# EasyEDA Pro project Balloon_PCB_Ver1.0.1.epro

# Board PCB（四层板）
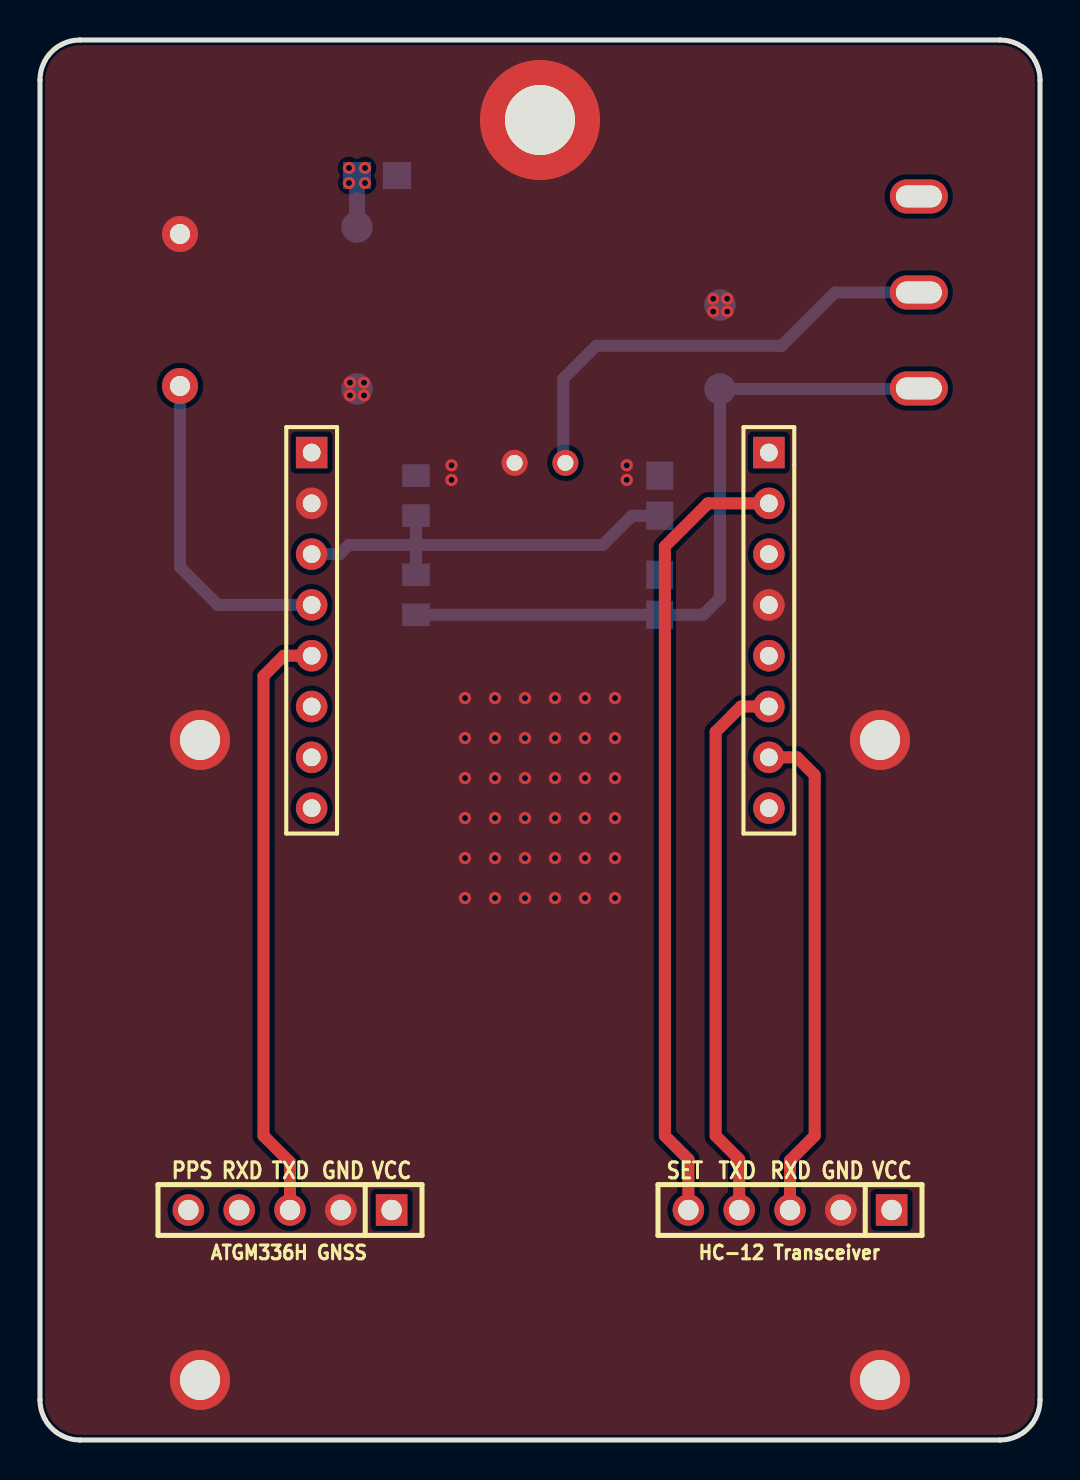
[diagram p0: board, top side]
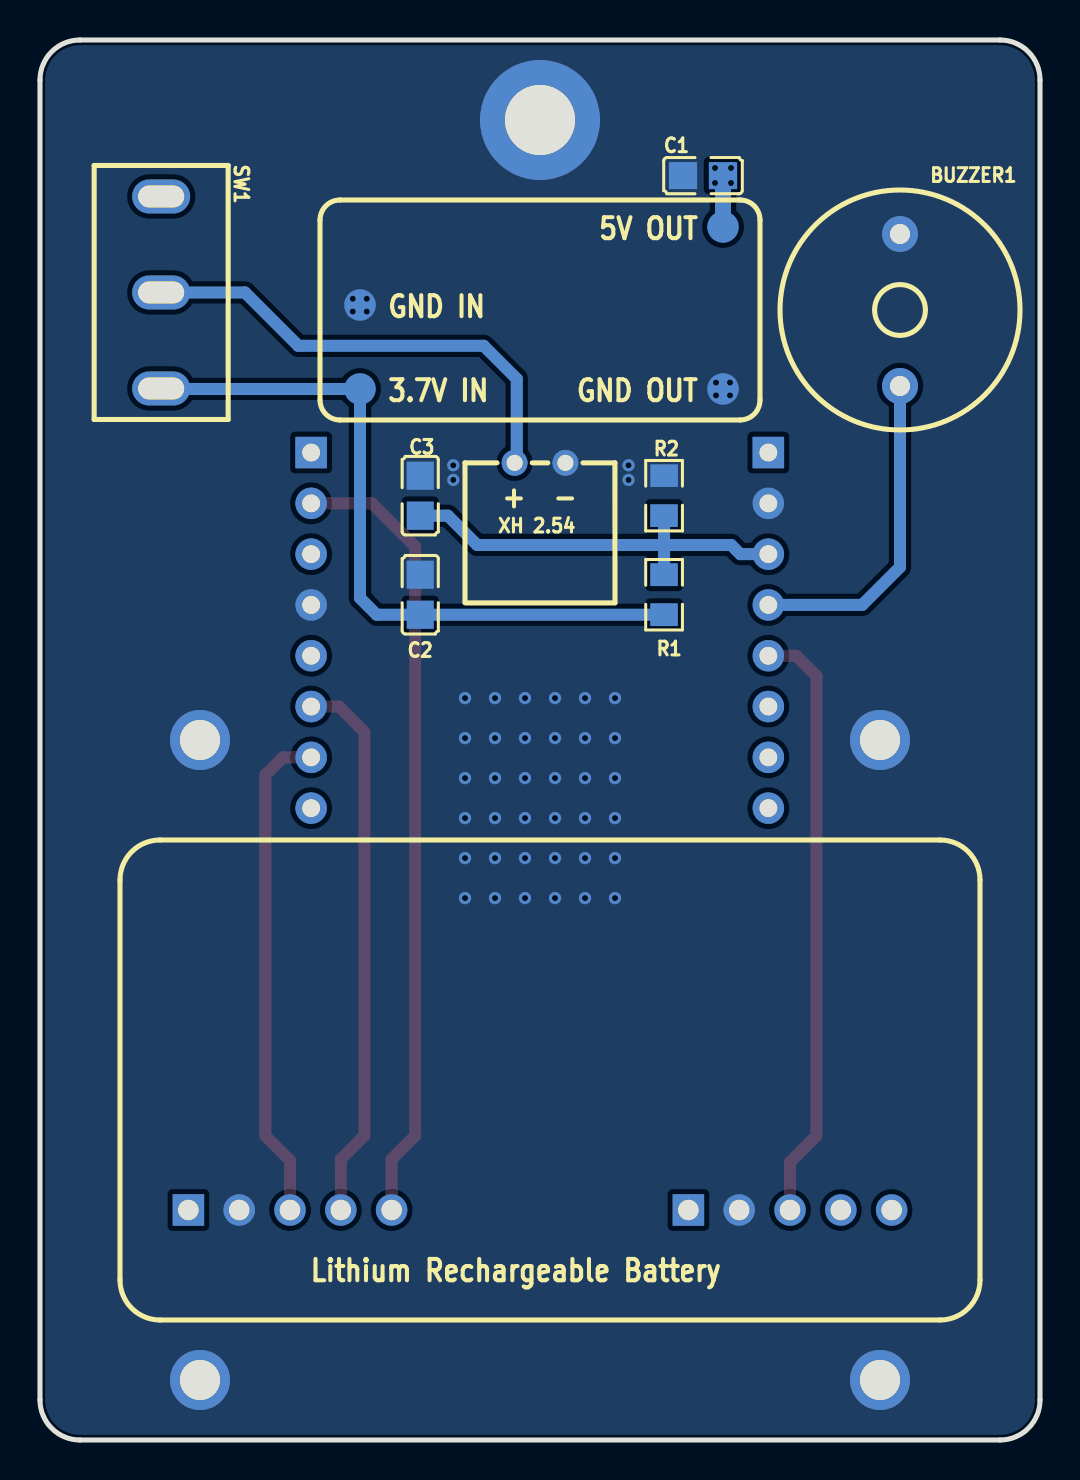
[diagram p1: board, bottom side, seen from below]

Outline 50 x 70 mm; copper layers: Top Layer, Inner1, Inner2, Bottom Layer. Coordinates in mm from the lower left corner of the outline.
Outline path: 0,68 0,2 arc(0.59,0.59) 2,0 48,0 arc(49.41,0.59) 50,2 50,68 arc(49.41,69.41) 48,70 2,70 arc(0.59,69.41) 0,68
Stack: Top Layer 0.035mm 外层铜厚1oz / Dielectric1 0.2104mm 7628 RC49% 8.6mil / Inner1 0.0152mm 内层铜厚 / Dielectric2 1.065mm 1.1mm H/HOZ Copper / Inner2 0.0152mm 内层铜厚 / Dielectric3 0.2104mm 7628 RC49% 8.6mil / Bottom Layer 0.035mm 外层铜厚1oz

## Design rules (mm)
template: 自定义配置
spacing copperThickness1oz (default): track to track 0.102, other pairs 0.152 to 0.3
spacing copperThickness2oz: track to track 0.203, other pairs 0.152 to 0.3
track width copperThickness1oz (default): min 0.127, default 0.254, max 2.54
track width copperThickness2oz: min 0.203, default 0.254, max 2.54
differential pair differentialPair (default): width min 0.127, default 0.254, max 2.54; gap min 0.152, default 0.152
via viaSize (default): diameter min 0.5, default 0.61, max 10; hole min 0.3, default 0.305, max 6.3
net GND uses copperThickness2oz
net 3.7V uses copperThickness2oz
net 5.0V uses copperThickness2oz
net GPSTX uses copperThickness2oz
net HCTX uses copperThickness2oz
net HTRX uses copperThickness2oz
net BUZZ+ uses copperThickness2oz

## Placement (name value [footprint] x y rotation side)
ATGM336H GNSS  B254YP-ZD05P  [HDR-TH_5P-P2.54-V-F]  12.5 11.5 180 top
BUZZER1  2.4kHz  [BUZ-TH_BD12.0-P7.60-D0.6-FD]  7 56.5 90 bottom
C1  22nF  [C0805]  16.85 63.22 180 bottom
C2  100nF  [C0805]  30.99 42.26 270 bottom
C3  100nF  [C0805]  30.99 47.22 270 bottom
ESP32 CAM  -  [ESP32-CAM]  11.5 67 0 top
HC-12 Transceiver  B254YP-ZD05P  [HDR-TH_5P-P2.54-V-F]  37.5 11.5 180 top
NOREF  -  [Pad_e14]  25 66 0 top
NOREF#2  -  [Pad_e609]  42 35 0 top
NOREF#3  -  [Pad_e611]  8 3 0 top
NOREF#4  -  [Pad_e295]  34 52.55 90 top
NOREF#5  -  [Pad_e296]  15.85 52.55 90 top
NOREF#6  -  [Pad_e610]  42 3 0 top
NOREF#7  -  [Pad_e607]  8 35 0 top
NOREF#8  -  [Pad_e294]  34 56.75 90 top
NOREF#9  -  [Pad_e297]  15.85 60.65 90 top
R1  10kΩ  [R0805]  18.8 42.26 90 bottom
R2  1kΩ  [R0805]  18.8 47.22 270 bottom
SW1  SS12D10G4 071  [SW-TH_SHOU-HAN_SS12D10G4]  43.94 57.38 270 bottom
XH 2.54  2.54-2P WZ-D  [CONN-TH_2P-P2.54_WZ-D]  25 48.86 180 bottom

## Footprints (pads in the part's own frame, mm; a bottom-side part is the same pattern mirrored in y, then rotated)
BUZ-TH_BD12.0-P7.60-D0.6-FD
  round 1.8 hole 1: 1(-3.8,0) 2(3.8,0)
C0805
  rect 1.41x1.35 smd: 1(-1,0) 2(1,0)
CONN-TH_2P-P2.54_WZ-D
  round 1.3 hole 0.8: 1(-1.27,0) 2(1.27,0)
ESP32-CAM
  rect 1.575x1.575 hole 0.889: 1(2.083,-17.628) 16(24.943,-17.628)
  round 1.575 hole 0.889: 2(2.083,-20.168) 3(2.083,-22.707) 4(2.083,-25.247) 5(2.083,-27.788) 6(2.083,-30.328) 7(2.083,-32.867) 8(2.083,-35.407) 9(24.943,-35.407) 10(24.943,-32.867) 11(24.943,-30.328) 12(24.943,-27.788) 13(24.943,-25.247) 14(24.943,-22.707) 15(24.943,-20.168)
HDR-TH_5P-P2.54-V-F
  rect 1.575x1.575 hole 1.02: 1(-5.08,0)
  round 1.575 hole 1.02: 2(-2.54,0) 3(0,0) 4(2.54,0) 5(5.08,0)
Pad_e14
  round 6 hole 3.5: 1(0,0)
Pad_e294
  round 1.575 smd far side: 1(0,0)
Pad_e295
  round 1.575 smd far side: 2(0,0)
Pad_e296
  round 1.575 smd far side: 3(0,0)
Pad_e297
  round 1.575 smd far side: 4(0,0)
Pad_e607
  round 3 hole 2: 1(0,0)
Pad_e609
  round 3 hole 2: 1(0,0)
Pad_e610
  round 3 hole 2: 1(0,0)
Pad_e611
  round 3 hole 2: 1(0,0)
R0805
  rect 1.133x1.377 smd: 1(-1,0) 2(1,0)
SW-TH_SHOU-HAN_SS12D10G4
  oval 1.7x2.9 hole 1.1x2.3: 1(-4.8,0) 2(0,0) 3(4.8,0)

## Nets
3.7V: C2.2 NOREF#4.2 R1.1 SW1.3
5.0V: ATGM336H GNSS.1 C1.2 ESP32 CAM.1 HC-12 Transceiver.1 NOREF#9.4
GND: ATGM336H GNSS.2 BUZZER1.2 C1.1 C2.1 C3.1 ESP32 CAM.2 ESP32 CAM.13 HC-12 Transceiver.2 NOREF.1 NOREF#2.1 NOREF#3.1 NOREF#5.3 NOREF#6.1 NOREF#7.1 NOREF#8.1 R2.1 XH 2.54.2
BAT-3.7V: SW1.2 XH 2.54.1
BUZZ+: BUZZER1.1 ESP32 CAM.4
GPSTX: ATGM336H GNSS.3 ESP32 CAM.5
HCTX: ESP32 CAM.11 HC-12 Transceiver.4
HTRX: ESP32 CAM.10 HC-12 Transceiver.3
V_TEST: C3.2 ESP32 CAM.3 R1.2 R2.2

Pads without a net: ATGM336H GNSS 4 5; ESP32 CAM 6 7 8 9 12 14 15 16; HC-12 Transceiver 5; SW1 1

## Via types
v1: diameter 0.61, hole 0.305, Top Layer to Bottom Layer, 52 vias

## Routing (per net, layer and track width the routed paths; a pad name or vN(x,y) marks a point on that pad's centre or on a via; arc(x,y) is an arc through that point)
3.7V: length 35.9
  Bottom Layer w0.6: R1.1 C2.2 33.16,41.26 34,42.1 NOREF#4.2 43.94,52.55
5.0V: length 2.6
  Bottom Layer w0.8: NOREF#9.4 C1.2
  vias: v1(15.45,63.6) v1(15.45,62.85) v1(16.25,63.6) v1(16.25,62.85)
GND:
  vias: v1(15.5,52.87) v1(15.5,52.23) v1(16.2,52.87) v1(16.2,52.23) v1(20.57,48.74) v1(20.57,48) v1(21.25,37.09) v1(21.25,35.09) v1(21.25,33.09) v1(21.25,31.09) v1(21.25,29.09) v1(21.25,27.09) v1(22.75,37.09) v1(22.75,35.09) v1(22.75,33.09) v1(22.75,31.09) v1(22.75,29.09) v1(22.75,27.09) v1(24.25,37.09) v1(24.25,35.09) v1(24.25,33.09) v1(24.25,31.09) v1(24.25,29.09) v1(24.25,27.09) v1(25.75,37.09) v1(25.75,35.09) v1(25.75,33.09) v1(25.75,31.09) v1(25.75,29.09) v1(25.75,27.09) v1(27.25,37.09) v1(27.25,35.09) v1(27.25,33.09) v1(27.25,31.09) v1(27.25,29.09) v1(27.25,27.09) v1(28.75,37.09) v1(28.75,35.09) v1(28.75,33.09) v1(28.75,31.09) v1(28.75,29.09) v1(28.75,27.09) v1(29.34,48.74) v1(29.34,48) v1(33.66,57.06) v1(33.66,56.42) v1(34.36,57.06) v1(34.36,56.42)
(no net): length 39.8
  Top Layer w0.6: ESP32 CAM.15 33.4,46.83 31.24,44.68 31.24,15.21 32.42,14.03 HC-12 Transceiver.5
BAT-3.7V: length 23.8
  Bottom Layer w0.6: XH 2.54.1 26.16,48.97 26.16,53.06 27.81,54.71 37.08,54.71 39.75,57.38 SW1.2
BUZZ+: length 16.4
  Bottom Layer w0.6: BUZZER1.1 7,43.64 8.89,41.75 13.58,41.75
GPSTX: length 30.1
  Top Layer w0.6: ESP32 CAM.5 12.19,39.21 11.18,38.2 11.18,15.21 12.5,13.89 ATGM336H GNSS.3
HCTX: length 27.6
  Top Layer w0.6: ESP32 CAM.11 35.05,36.67 33.78,35.41 33.78,15.21 34.96,14.03 HC-12 Transceiver.4
HTRX: length 24.9
  Top Layer w0.6: ESP32 CAM.10 37.85,34.13 38.74,33.25 38.74,15.21 37.5,13.98 HC-12 Transceiver.3
V_TEST: length 21.2
  Bottom Layer w0.6: 18.8,44.75 R1.2 ; 18.8,44.75 28.14,44.75 29.61,46.22 C3.2 ; 18.8,44.75 R2.2 ; 18.8,44.75 15.44,44.75 14.98,44.29 ESP32 CAM.3

## Copper pours and planes (outline as drawn; the poured copper is in the pictures)
5.0V on Inner1: 0.26,69.74 49.74,69.74 49.74,0.26 0.26,0.26
GND on Top Layer: 0,68 0.02,68.28 0.08,68.56 0.18,68.83 0.32,69.08 0.49,69.31 0.69,69.51 0.92,69.68 1.17,69.82 1.44,69.92 1.72,69.98 2,70 48,70 48.28,69.98 48.56,69.92 48.83,69.82 49.08,69.68 49.31,69.51 49.51,69.31 49.68,69.08 49.82,68.83 49.92,68.56 49.98,68.28 50,68 50,2 49.98,1.72 49.92,1.44 49.82,1.17 49.68,0.92 49.51,0.69 49.31,0.49 49.08,0.32 48.83,0.18 48.56,0.08 48.28,0.02 48,0 2,0 1.72,0.02 1.44,0.08 1.17,0.18 0.92,0.32 0.69,0.49 0.49,0.69 0.32,0.92 0.18,1.17 0.08,1.44 0.02,1.72 0,2
GND on Bottom Layer: 0,68 0.02,68.28 0.08,68.56 0.18,68.83 0.32,69.08 0.49,69.31 0.69,69.51 0.92,69.68 1.17,69.82 1.44,69.92 1.72,69.98 2,70 48,70 48.28,69.98 48.56,69.92 48.83,69.82 49.08,69.68 49.31,69.51 49.51,69.31 49.68,69.08 49.82,68.83 49.92,68.56 49.98,68.28 50,68 50,2 49.98,1.72 49.92,1.44 49.82,1.17 49.68,0.92 49.51,0.69 49.31,0.49 49.08,0.32 48.83,0.18 48.56,0.08 48.28,0.02 48,0 2,0 1.72,0.02 1.44,0.08 1.17,0.18 0.92,0.32 0.69,0.49 0.49,0.69 0.32,0.92 0.18,1.17 0.08,1.44 0.02,1.72 0,2
GND on Inner2: 0.26,69.74 49.74,69.74 49.74,0.26 0.26,0.26

## Text on the board
Bottom Silkscreen Layer: GND IN | 3.7V IN | - | + | 5V OUT | GND OUT | Lithium Rechargeable Battery
Top Silkscreen Layer: PPS | RXD | TXD | GND | VCC | SET
